# EAGLE design CCM0004 (EAGLE 6.5.0)
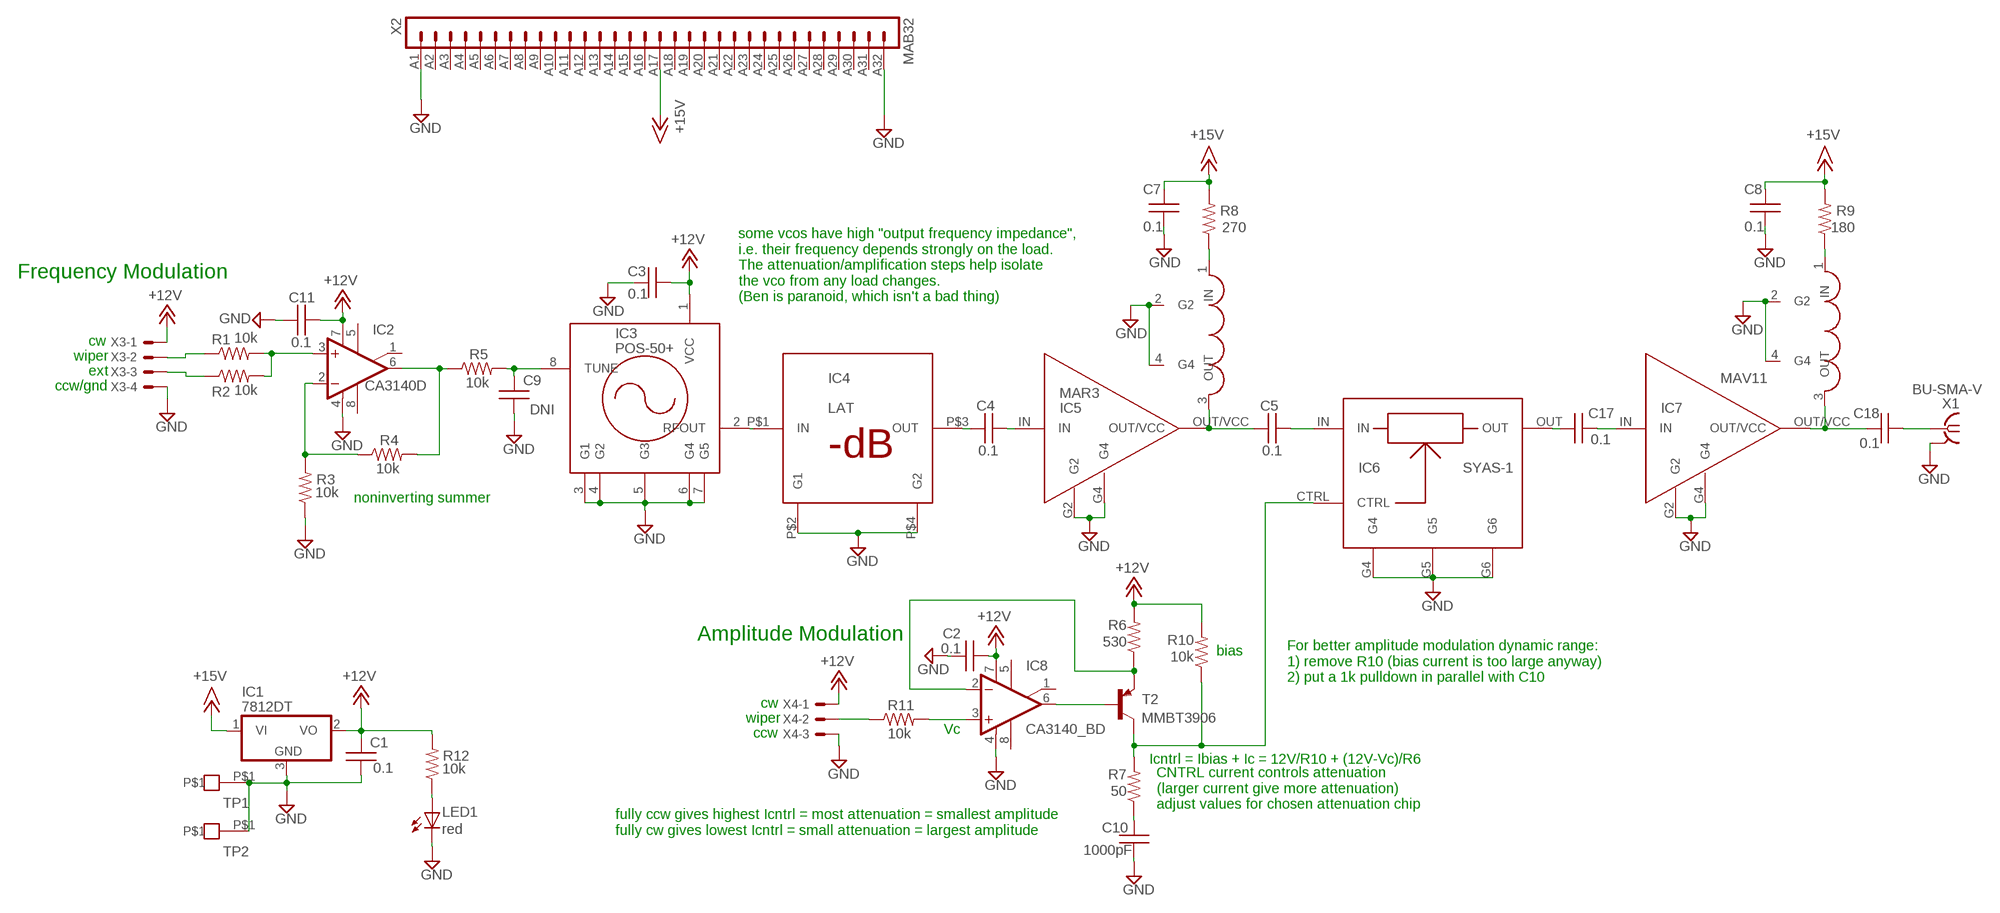
[diagram p0: schematic, sheet 1]

## Parts
C1  0.1  CAPACITOR0603  [0603]
C2  0.1  CAPACITOR0603  [0603]
C3  0.1  CAPACITOR0603  [0603]
C4  0.1  CAPACITOR2010  [2010]
C5  0.1  CAPACITOR2010  [2010]
C7  0.1  CAPACITOR0603  [0603]
C8  0.1  CAPACITOR0603  [0603]
C9  DNI  CAPACITOR0603  [0603]
C10  1000pF  CAPACITOR2010  [2010]
C11  0.1  CAPACITOR0603  [0603]
C17  0.1  CAPACITOR2010  [2010]
C18  0.1  CAPACITOR2010  [2010]
IC1  7812DT  [TO252]
IC2  CA3140D  [SO08]
IC3  POS-50+  POS  [A01]
IC4  LAT  [MMM168]
IC5  MAR3  [MAR]
IC6  SYAS-1  [TTT166]
IC7  MAV11  [MAR]
IC8  CA3140_BD  [SO08]
L1  TCCH-80  [PL-147]
L2  TCCH-80  [PL-147]
LED1  red  LEDCHIPLED_0603  [CHIPLED_0603]
R1  10k  RESISTOR0603  [0603]
R2  10k  RESISTOR0603  [0603]
R3  10k  RESISTOR0603  [0603]
R4  10k  RESISTOR0603  [0603]
R5  10k  RESISTOR0603  [0603]
R6  530  RESISTOR2010  [2010]
R7  50  RESISTOR2010  [2010]
R8  270  RESISTOR2010  [2010]
R9  180  RESISTOR2010  [2010]
R10  10k  RESISTOR2010  [2010]
R11  10k  RESISTOR0603  [0603]
R12  10k  RESISTOR0603  [0603]
T2  MMBT3906  MMBT3906LT1SMD  [SOT23-BEC]
TP1  TESTPOINT  [TESTPOINT]
TP2  TESTPOINT  [TESTPOINT]
X1  BU-SMA-V  [BU-SMA-V]
X2  MAB32  [MAB32]
X3  22-23-2041  [22-23-2041]
X4  22-23-2031  [22-23-2031]

## Nets
+12V: C1.1 C2.2 C3.1 C11.2 IC1.2(VO) IC2.7(V+) IC3.1(VCC) IC8.7(V+) R6.2 R10.2 R12.2 X3.1 X4.1
+15V: C7.1 C8.1 IC1.1(VI) R8.2 R9.2 X2.A17
GND: C1.2 C2.1 C3.2 C7.2 C8.2 C9.2 C10.1 C11.1 IC1.3(GND) IC2.4(V-) IC3.3(G1) IC3.4(G2) IC3.5(G3) IC3.6(G4) IC3.7(G5) IC4.P$2(G1) IC4.P$4(G2) IC5.G2 IC5.G4 IC6.G4 IC6.G5 IC6.G6 IC7.G2 IC7.G4 IC8.4(V-) L1.2(G2) L1.4(G4) L2.2(G2) L2.4(G4) LED1.C R3.1 TP1.P$1 TP2.P$1 X1.2(GND) X2.A1 X2.A32 X3.4 X4.3
N$1: IC8.6(OUT) T2.B
N$2: IC8.2(-IN) R6.1 T2.E
N$3: C10.2 R7.1
N$4: R1.1 X3.2
N$5: IC6.CTRL R7.2 R10.1 T2.C
N$6: R2.1 X3.3
N$7: R11.1 X4.2
N$8: IC8.3(+IN) R11.2
N$9: LED1.A R12.1
N$34: IC2.3(+IN) R1.2 R2.2
N$35: IC2.2(-IN) R3.2 R4.1
N$36: IC2.6(OUT) R4.2 R5.1
N$39: C9.1 IC3.8(TUNE) R5.2
N$40: L2.1(IN) R9.1
N$41: IC3.2(RFOUT) IC4.P$1(IN)
N$42: C4.1 IC4.P$3(OUT)
N$43: C4.2 IC5.IN
N$44 [stripline]: C5.1 IC5.OUT/VCC L1.3(OUT)
N$45 [stripline]: C5.2 IC6.IN
N$46 [stripline]: C17.2 IC7.IN
N$47 [stripline]: C18.1 IC7.OUT/VCC L2.3(OUT)
N$48: L1.1(IN) R8.1
N$49 [stripline]: C17.1 IC6.OUT
N$50: C18.2 X1.1
Unconnected: IC2.1(ON/CMP) IC2.5(ON) IC2.8(CMP) IC8.1(ON/CMP) IC8.5(ON) IC8.8(CMP) X2.A2 X2.A3 X2.A4 X2.A5 X2.A6 X2.A7 X2.A8 X2.A9 X2.A10 X2.A11 X2.A12 X2.A13 X2.A14 X2.A15 X2.A16 X2.A18 X2.A19 X2.A20 X2.A21 X2.A22 X2.A23 X2.A24 X2.A25 X2.A26 X2.A27 X2.A28 X2.A29 X2.A30 X2.A31

## Notes on the sheet
- Frequency Modulation
- some vcos have high "output frequency impedance",
  i.e. their frequency depends strongly on the load.
  The attenuation/amplification steps help isolate 
  the vco from any load changes.
  (Ben is paranoid, which isn't a bad thing)
- cw
- wiper
- ext
- ccw/gnd
- noninverting summer
- Amplitude Modulation
- bias
- For better amplitude modulation dynamic range:
  1) remove R10 (bias current is too large anyway)
  2) put a 1k pulldown in parallel with C10
- cw
- wiper
- ccw | Vc
- Icntrl = Ibias + Ic = 12V/R10 + (12V-Vc)/R6
- CNTRL current controls attenuation
  (larger current give more attenuation)
  adjust values for chosen attenuation chip
- fully ccw gives highest Icntrl = most attenuation = smallest amplitude
  fully cw gives lowest Icntrl = small attenuation = largest amplitude

## Power pins joined to a net without a drawn wire
GND: X1.3(GND) X1.4(GND) X1.5(GND)

## Library data of the parts
C1-C5 C7-C11 C17 C18 = ic:CAPACITOR
IC1 = ic:78*: Positive VOLTAGE REGULATOR Source: http://cache.national.com/ds/LM/LM78L05.pdf http://www.fairchildsemi.com/ds/LM/LM7805.pdf
IC2 = ic:CA3140: OP AMP
IC3 = ic:POS: MiniCircuits POS-x VCO, through hole package
IC4 = ic:LAT: Minicircuits surface mount attenuator
IC5 = ic:MAR3: MiniCircuits MAR-3+ amplifier
IC6 = ic:SYAS-1: MiniCircuits voltage variable attenuator
IC7 = ic:MAV11: MiniCircuits MAV-11 amplifer, currently identical to MAR-3
IC8 = ic:CA3140_B: OP AMP
L1 L2 = ic:TCCH-80: MiniCircuits TCCH-80+ choke
LED1 = led:LED: LED OSRAM: - CHIPLED LG R971, LG N971, LY N971, LG Q971, LY Q971, LO R971, LY R971 LH N974, LH R974 LS Q976, LO Q976, LY Q976 LO Q996 - Hyper CHIPLED LW Q18S LB Q993, LB Q99A, LB R99A - SideLED LS A670, LO A670, LY A670, LG A670, LP A670 LB A673, LV A673, LT A673, LW A673 LH A674 LY A675 LS A676, LA A676, LO A676, LY A676, LW A676 LS A679, LY A679, LG A679 - Hyper Micro SIDELED® LS Y876, LA Y876, LO Y876, LY Y876 LT Y87S - SmartLED LW L88C, LW L88S LB L89C, LB L89S, LG L890 LS L89K, LO L89K, LY L89K LS L896, LA L896, LO L896, LY L896 - TOPLED LS T670, LO T670, LY T670, LG T670, LP T670 LSG T670, LSP T670, LSY T670, LOP T670, LYG T670 LG T671, LOG T671, LSG T671 LB T673, LV T673, LT T673, LW T673 LH T674 LS T676, LA T676, LO T676, LY T676, LB T676, LH T676, LSB T676, LW T676 LB T67C, LV T67C, LT T67C, LS T67K, LO T67K, LY T67K, LW E67C LS E67B, LA E67B, LO E67B, LY E67B, LB E67C, LV E67C, LT E67C LW T67C LS T679, LY T679, LG T679 LS T770, LO T770, LY T770, LG T770, LP T770 LB T773, LV T773, LT T773, LW T773 LH T774 LS E675, LA E675, LY E675, LS T675 LS T776, LA T776, LO T776, LY T776, LB T776 LHGB T686 LT T68C, LB T68C - Hyper Mini TOPLED® LB M676 - Mini TOPLED Santana® LG M470 LS M47K, LO M47K, LY M47K Source: http://www.osram.convergy.de LUXEON: - LUMILED® LXK2-PW12-R00, LXK2-PW12-S00, LXK2-PW14-U00, LXK2-PW14-V00 LXK2-PM12-R00, LXK2-PM12-S00, LXK2-PM14-U00 LXK2-PE12-Q00, LXK2-PE12-R00, LXK2-PE12-S00, LXK2-PE14-T00, LXK2-PE14-U00 LXK2-PB12-K00, LXK2-PB12-L00, LXK2-PB12-M00, LXK2-PB14-N00, LXK2-PB14-P00, LXK2-PB14-Q00 LXK2-PR12-L00, LXK2-PR12-M00, LXK2-PR14-Q00, LXK2-PR14-R00 LXK2-PD12-Q00, LXK2-PD12-R00, LXK2-PD12-S00 LXK2-PH12-R00, LXK2-PH12-S00 LXK2-PL12-P00, LXK2-PL12-Q00, LXK2-PL12-R00 Source: www.luxeon.com KINGBRIGHT: KA-3528ASYC Source: www.kingbright.com
R1-R12 = ic:RESISTOR: RESISTOR, American symbol
T2 = transistor-pnp:MMBT3906*: PNP Transistror
TP1 TP2 = Fitch:TESTPOINT
X1 = con-coax:BU-SMA-V: FEMALE SMA CONNECTOR Radiall distributor RS 112-3794
X2 = ic:MAB32: CONNECTOR male, 32 pins, type B, row A, grid 2.54 mm
X3 = con-molex:22-23-2041: .100" (2.54mm) Center Header - 4 Pin; MF: MOLEX; MPN: 22-23-2041; OC_FARNELL: 1462920; OC_NEWARK: 38C0355
X4 = con-molex:22-23-2031: .100" (2.54mm) Center Header - 3 Pin; MF: MOLEX; MPN: 22-23-2031; OC_FARNELL: 1462950; OC_NEWARK: 30C0862

## Net classes
1 stripline: width 1.778 mm, clearance 1.27 mm

## Board
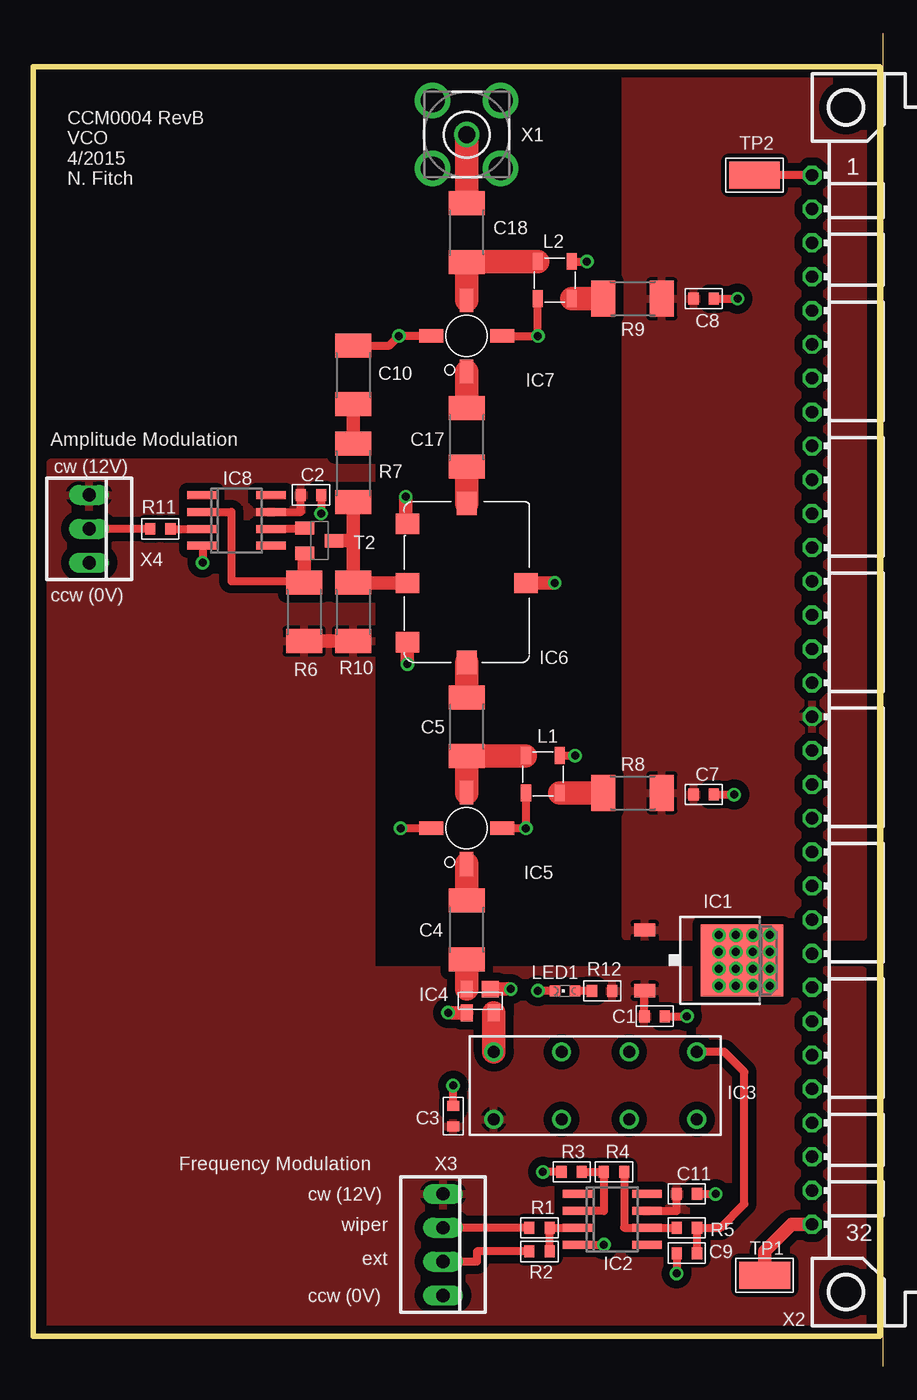
[diagram p1: board, top side]
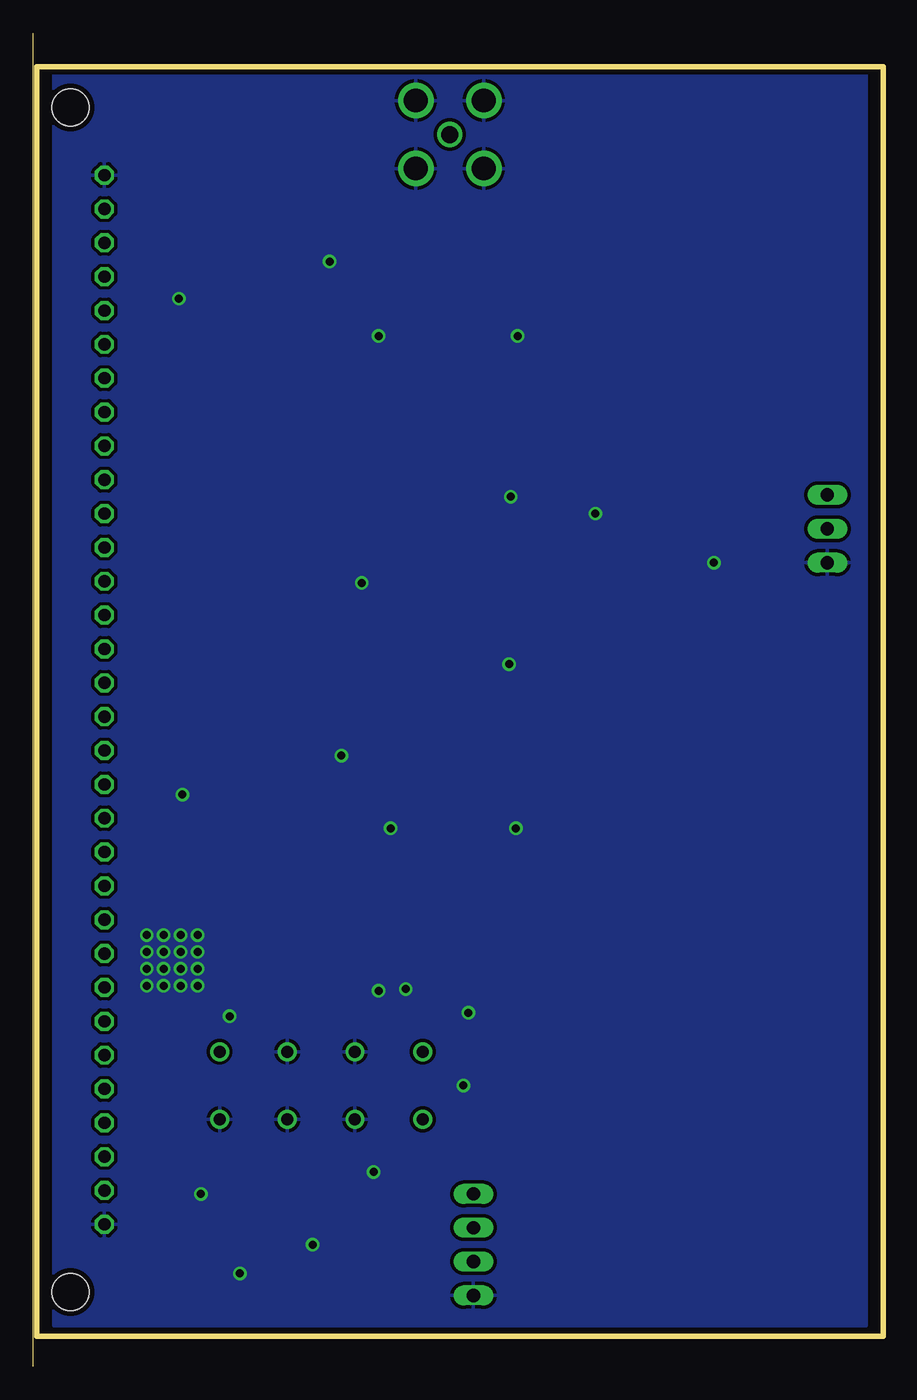
[diagram p2: board, bottom side, seen from below]

Size 63.5 x 95.25 mm. Coordinates in mm from the lower left corner, seen from the top.
Outline: 0,0 0,95.25 63.5,95.25 63.5,0 0,0
Copper layers (1*16): Top 0.035mm / dielectric 1.5mm / Bottom 0.035mm
Design rules "default *": minimum track width 10mil, minimum drill 20mil, track to track 8mil, track to pad 8mil, pad to pad 8mil, via to via 8mil, smd to smd 8mil, copper to edge 15mil, drill to drill 8mil, minimum pad ring 10mil, minimum via ring 8mil, stop-mask expansion 4mil, vias tented up to drill 0mil, thermal gap 10mil

### Footprints (pad centres in the part's own frame; a part is rotated, then mirrored left to right if it is on the bottom)
0603 = smd 0.762 x 0.889: 1 -0.762,0; 2 0.762,0
2010 = smd 1.8 x 2.7: 1 -2.2,0; 2 2.2,0
TO252 = smd 1 x 1.6: 1 -2.28,-4.8; 2 2.28,-4.8 | smd 5.4 x 6.2: 3 0,2.5
SO08 = smd 0.6 x 2.2: 1 -1.905,-2.6; 2 -0.635,-2.6; 3 0.635,-2.6; 4 1.905,-2.6; 5 1.905,2.6; 6 0.635,2.6; 7 -0.635,2.6; 8 -1.905,2.6
A01 = drill 0.9 pad 1.422: 1 -10.16,-3.81; 2 -10.16,1.27; 3 -5.08,-3.81; 4 -5.08,1.27; 5 0,-3.81; 6 0,1.27; 7 5.08,-3.81; 8 5.08,1.27
MMM168 = smd 0.889 x 1.27: P$1 -1.016,0.889; P$2 1.016,0.889; P$3 1.016,-0.889 | smd 1.27 x 1.27: P$4 -0.762,-0.889
MAR = smd 1.016 x 1.778: G2 0,2.667; G4 0,-2.667 | smd 1.778 x 1.016: IN -2.667,0; OUT/VCC 2.667,0
TTT166 = smd 1.524 x 1.778: CTRL 0,-4.445; G4 0,4.445; G5 -4.445,-4.445; G6 4.445,-4.445 | smd 1.778 x 1.524: IN 5.969,0; OUT -5.969,0
PL-147 = smd 0.762 x 1.27: 1 -1.27,1.397; 2 1.27,1.397; 3 1.27,-1.397; 4 -1.27,-1.397
CHIPLED_0603 = smd 0.8 x 0.8: A 0,-0.75; C 0,0.75
SOT23-BEC = smd 1 x 1.4: B -0.95,-1.1; C 0,1.1; E 0.95,-1.1
TESTPOINT = smd 3.81 x 2.032: P$1 0,0
BU-SMA-V = drill 1.27: 1 0,0 | drill 1.778: 2 -2.55,2.55; 3 2.55,2.55; 4 2.55,-2.55; 5 -2.55,-2.55
MAB32 = drill 0.914 octagon: A1 -2.54,39.37; A2 -2.54,36.83; A3 -2.54,34.29; A4 -2.54,31.75; A5 -2.54,29.21; A6 -2.54,26.67; A7 -2.54,24.13; A8 -2.54,21.59; A9 -2.54,19.05; A10 -2.54,16.51; A11 -2.54,13.97; A12 -2.54,11.43; A13 -2.54,8.89; A14 -2.54,6.35; A15 -2.54,3.81; A16 -2.54,1.27; A17 -2.54,-1.27; A18 -2.54,-3.81; A19 -2.54,-6.35; A20 -2.54,-8.89; A21 -2.54,-11.43; A22 -2.54,-13.97; A23 -2.54,-16.51; A24 -2.54,-19.05; A25 -2.54,-21.59; A26 -2.54,-24.13; A27 -2.54,-26.67; A28 -2.54,-29.21; A29 -2.54,-31.75; A30 -2.54,-34.29; A31 -2.54,-36.83; A32 -2.54,-39.37 | hole 2.794: 0,44.45; 0,-44.45
22-23-2041 = drill 1 long: 1 -3.81,0; 2 -1.27,0; 3 1.27,0; 4 3.81,0
22-23-2031 = drill 1 long: 1 -2.54,0; 2 0,0; 3 2.54,0

### Placement (x,y rotation side)
C1  46.61,24 0 top
C2  20.83,63.12 180 top
C3  31.5,16.51 90 top
C4  32.51,30.48 90 top
C5  32.51,45.72 90 top
C7  50.29,40.64 0 top
C8  50.29,77.85 0 top
C9  49.02,6.22 180 top
C10  24,72.14 270 top
C11  49.02,10.67 180 top
C17  32.51,67.44 90 top
C18  32.51,82.8 90 top
IC1  50.67,28.19 270 top
IC2  43.43,8.76 270 top
IC3  44.7,20.07 0 top
IC4  33.53,25.15 180 top
IC5  32.51,38.1 90 top
IC6  32.51,56.52 270 top
IC7  32.51,75.06 90 top
IC8  15.24,61.21 270 top
L1  38.23,42.16 180 top
L2  39.12,79.25 180 top
LED1  39.88,25.91 90 top
R1  37.97,8.13 0 top
R2  37.97,6.35 0 top
R3  40.39,12.32 0 top
R4  43.56,12.32 0 top
R5  49.02,8.13 0 top
R6  20.32,54.36 270 top
R7  24,64.77 270 top
R8  44.96,40.77 0 top
R9  44.96,77.85 0 top
R10  24,54.36 270 top
R11  9.53,60.58 0 top
R12  42.67,25.91 0 top
T2  21.46,59.69 270 top
TP1  54.86,4.57 0 top
TP2  54.1,87.12 0 top
X1  32.51,90.17 0 top
X2  60.96,47.75 0 top
X3  30.73,6.86 270 top
X4  4.19,60.58 270 top

### Tracks (layer width: path | path; a pad name or v marks a point on that pad's centre or on a via)
+12V
  Top 0.61: IC2.7 48.26,9.4 C11.2 | IC8.7 20.07,61.85 C2.2 | C1.1 45.85,25.91 IC1.2
  Top 1.016: R10.2 R6.2
  pour Top (isolate 0.61): 62.23,27.43 25.4,27.43 25.4,65.53 1.27,65.53 1.27,0.76 62.23,0.76
+15V
  pour Top (isolate 0.61): 62.23,94.74 62.23,29.97 44.45,29.97 44.45,94.74
GND  (via drill 0.6)
  Top 0.61: IC2.4 v42.8,6.86 | C9.2 v48.26,4.7 | C11.1 v51.18,10.67 | IC1.3 53.17,28.83 v52.7,28.83 | C1.2 v49.02,24 | C3.2 v31.5,18.8 | R3.1 v38.23,12.32 | IC8.4 12.7,59.31 v12.7,58.04 | C2.1 v21.59,61.72 | C7.2 v52.58,40.64 | L1.4 v40.64,43.56 | L1.2 v36.96,38.1 IC5.G4 | IC5.G2 v27.56,38.1 | IC7.G2 v27.43,75.06 26.71,74.34 C10.1 | C8.2 v52.83,77.85 | L2.4 v41.53,80.64 | IC7.G4 v37.85,75.06 L2.2 | X2.A1 TP2.P$1 | LED1.C v37.85,25.91
  Top 1.016: IC4.P$4 v35.81,26.04 | IC4.P$2 v31.11,24.26 | IC6.G5 27.94,60.96 v27.94,62.99 | IC6.G4 v39.12,56.52 | IC6.G6 v28.07,50.42 | TP1.P$1 54.86,6.35 56.9,8.38 X2.A32
  other vias: 55.24,30.1 55.24,28.83 55.24,27.56 55.24,26.29 53.98,30.1 53.98,28.83 53.98,27.56 53.98,26.29 52.7,30.1 52.7,27.56 52.7,26.29 51.44,30.1 51.44,28.83 51.44,27.56 51.44,26.29
  pour Bottom (isolate 0.254): 1.27,0.76 1.27,94.74 62.23,94.74 62.23,0.76
N$1
  Top 0.61: T2.B 20.07,60.64 20.07,60.58 IC8.6
N$2
  Top 0.61: R6.1 20.32,56.64 14.86,56.64 14.86,61.85 IC8.2
  Top 1.016: T2.E 20.32,58.74 R6.1
N$3
  Top 1.016: R7.1 C10.2
N$4
  Top 0.61: R1.1 X3.2
N$5
  Top 1.016: T2.C 24,59.69 | 24,59.69 R10.1 24,56.52 IC6.CTRL | R7.2 24,59.69
N$6
  Top 0.61: R2.1 33.27,6.35 33.27,5.59 X3.3
N$7
  Top 0.61: R11.1 X4.2
N$8
  Top 0.61: R11.2 IC8.3
N$9
  Top 0.61: R12.1 LED1.A
N$34
  Top 0.61: R2.2 R1.2 IC2.3
N$35
  Top 0.61: IC2.2 42.8,9.4 R4.1 R3.2
N$36
  Top 0.61: R4.2 44.32,8.13 IC2.6 R5.1
N$39
  Top 0.61: C9.1 R5.2 51.56,8.13 53.34,9.91 53.34,19.81 51.82,21.34 IC3.8
N$40
  Top 1.778: L2.1 R9.1
N$41
  Top 1.778: IC3.2 IC4.P$1
N$42
  Top 1.778: C4.1 IC4.P$3
N$43
  Top 1.778: C4.2 IC5.IN
N$44
  Top 1.016: 36.92,43.52 L1.3
  Top 1.778: IC5.OUT/VCC C5.1 36.92,43.52
N$45
  Top 1.778: IC6.IN C5.2
N$46
  Top 1.778: IC7.IN C17.2
N$47
  Top 1.778: IC7.OUT/VCC C18.1 32.55,80.64 L2.3
N$48
  Top 1.778: L1.1 R8.1
N$49
  Top 1.778: IC6.OUT C17.1
N$50
  Top 1.778: X1.1 C18.2

### Text on the board
tNames: CCM0004 RevB / VCO / 4/2015 / N. Fitch | Amplitude Modulation | cw (12V) | ccw (0V) | Frequency Modulation | cw (12V) | wiper | ext | ccw (0V)